# EAGLE design teensy (EAGLE 9.1.1)
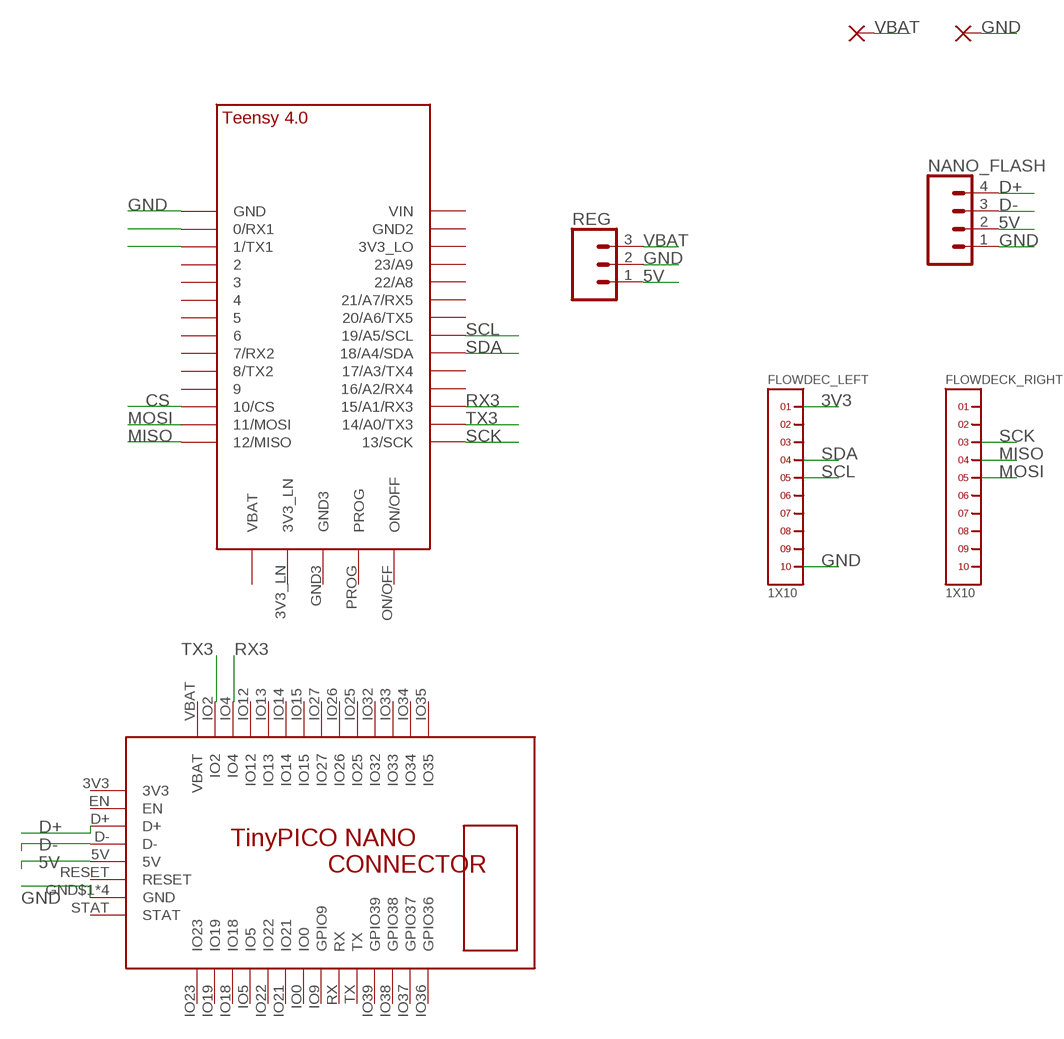
[diagram p0: schematic, sheet 1]

## Parts
FLOWDEC_LEFT  1X10  [1X10]
FLOWDECK_RIGHT  1X10  [1X10]
GND  SMD5  [SMD2,54-5,08]
NANO_FLASH  CONN_041X04_NO_SILK  [1X04_NO_SILK]
REG  CONN_031X03_NO_SILK  [1X03_NO_SILK]
U$1  TEENSY_4.0  [TEENSY_4.0]
U$2  TINYPICO-NANO-CONNECTOR  [TINYPICO-NANO-CONNECTOR]
VBAT  SMD5  [SMD2,54-5,08]

## Nets
3V3: FLOWDEC_LEFT.1
5V: NANO_FLASH.2 REG.1 U$2.5V
CS: U$1.10/CS
D+: NANO_FLASH.4 U$2.D+
D-: NANO_FLASH.3 U$2.D-
GND: FLOWDEC_LEFT.10 GND.1(P) NANO_FLASH.1 REG.2 U$1.GND U$2.GND$1(GND) U$2.GND$2(GND) U$2.GND$3(GND) U$2.GND$4(GND)
MISO: FLOWDECK_RIGHT.4 U$1.12/MISO
MOSI: FLOWDECK_RIGHT.5 U$1.11/MOSI
N$8: U$1.0/RX(0/RX1)
N$9: U$1.1/TX(1/TX1)
RX3: U$1.15/A1(15/A1/RX3) U$2.IO4
SCK: FLOWDECK_RIGHT.3 U$1.13/SCK
SCL: FLOWDEC_LEFT.5 U$1.19/A5/SCL
SDA: FLOWDEC_LEFT.4 U$1.18/A4/SDA
TX3: U$1.14/A0(14/A0/TX3) U$2.IO2
VBAT: REG.3 VBAT.1(P)
Unconnected: FLOWDEC_LEFT.2 FLOWDEC_LEFT.3 FLOWDEC_LEFT.6 FLOWDEC_LEFT.7 FLOWDEC_LEFT.8 FLOWDEC_LEFT.9 FLOWDECK_RIGHT.1 FLOWDECK_RIGHT.2 FLOWDECK_RIGHT.6 FLOWDECK_RIGHT.7 FLOWDECK_RIGHT.8 FLOWDECK_RIGHT.9 FLOWDECK_RIGHT.10 U$1.2 U$1.3/CANTX U$1.3V3_LN U$1.3V3_LO U$1.4/CANRX U$1.5 U$1.6 U$1.7(7/RX2) U$1.8(8/TX2) U$1.9/CS U$1.16/A2(16/A2/RX4) U$1.17/A3(17/A3/TX4) U$1.20/A6(20/A6/TX5) U$1.21/A7(21/A7/RX5) U$1.22/A8 U$1.23/A9 U$1.GND2 U$1.GND3 U$1.ON/OFF U$1.PROG U$1.VBAT\(VBAT) U$1.VIN U$2.EN U$2.IO0 U$2.IO5 U$2.IO9(GPIO9) U$2.IO12 U$2.IO13 U$2.IO14 U$2.IO15 U$2.IO18 U$2.IO19 U$2.IO21 U$2.IO22 U$2.IO23 U$2.IO25 U$2.IO26 U$2.IO27 U$2.IO32 U$2.IO33 U$2.IO34 U$2.IO35 U$2.IO36(GPIO36) U$2.IO37(GPIO37) U$2.IO38(GPIO38) U$2.IO39(GPIO39) U$2.RESET U$2.RX U$2.STAT U$2.TX

## Power pins joined to a net without a drawn wire
3V3: U$2.3V3
VBAT: U$2.VBAT

## Library data of the parts
FLOWDEC_LEFT FLOWDECK_RIGHT = headers(2mm):1X10
GND VBAT = wirepad:SMD5: SMD PAD
NANO_FLASH = SparkFun-Connectors:CONN_04: Multi connection point. Often used as Generic Header-pin footprint for 0.1 inch spaced/style header connections On any of the 0.1 inch spaced packages, you can populate with these: Break Away Headers - Straight <https://www.sparkfun.com/products/116> (PRT-00116) Break Away Male Headers - Right Angle <https://www.sparkfun.com/products/553> (PRT-00553) Female Headers <https://www.sparkfun.com/products/115> (PRT-00115) Break Away Headers - Machine Pin <https://www.sparkfun.com/products/117> (PRT-00117) Break Away Female Headers - Swiss Machine Pin <https://www.sparkfun.com/products/743> (PRT-00743) For SCREWTERMINALS and SPRING TERMINALS visit here: Screw Terimnals on SparkFun.com <https://www.sparkfun.com/search/results?term=Screw+Terminals> (5mm/3.5mm/2.54mm spacing) This device is also useful as a general connection point to wire up your design to another part of your project. Our various solder wires solder well into these plated through hole pads. Hook-Up Wire - Assortment (Stranded, 22 AWG) <https://www.sparkfun.com/products/11375> (PRT-11375) Hook-Up Wire - Assortment (Solid Core, 22 AWG) <https://www.sparkfun.com/products/11367> (PRT-11367) View the entire wire category on our website here <https://www.sparkfun.com/categories/141> Special notes: Molex polarized connector foot print use with SKU : PRT-08231 with associated crimp pins and housings. 1MM SMD Version SKU: PRT-10208; PROD_ID: CONN-09696
REG = SparkFun-Connectors:CONN_03: Multi connection point. Often used as Generic Header-pin footprint for 0.1 inch spaced/style header connections On any of the 0.1 inch spaced packages, you can populate with these: Break Away Headers - Straight <https://www.sparkfun.com/products/116> (PRT-00116) Break Away Male Headers - Right Angle <https://www.sparkfun.com/products/553> (PRT-00553) Female Headers <https://www.sparkfun.com/products/115> (PRT-00115) Break Away Headers - Machine Pin <https://www.sparkfun.com/products/117> (PRT-00117) Break Away Female Headers - Swiss Machine Pin <https://www.sparkfun.com/products/743> (PRT-00743) Stackable Header - 3 Pin (Female, 0.1") <https://www.sparkfun.com/products/13875> (PRT-13875) For SCREWTERMINALS and SPRING TERMINALS visit here: Screw Terimnals on SparkFun.com <https://www.sparkfun.com/search/results?term=Screw+Terminals> (5mm/3.5mm/2.54mm spacing) This device is also useful as a general connection point to wire up your design to another part of your project. Our various solder wires solder well into these plated through hole pads. Hook-Up Wire - Assortment (Stranded, 22 AWG) <https://www.sparkfun.com/products/11375> (PRT-11375) Hook-Up Wire - Assortment (Solid Core, 22 AWG) <https://www.sparkfun.com/products/11367> (PRT-11367) View the entire wire category on our website here <https://www.sparkfun.com/categories/141> Special notes: Molex polarized connector foot print use with SKU : PRT-08232 with associated crimp pins and housings.
U$1 = TEENSY 4.0:TEENSY_4.0
U$2 = TinyPICO_NANO_Eagle:TINYPICO-NANO-CONNECTOR: TinyPICO NANO Footprint https://www.tinypico.com/tinypico-nano

## Board
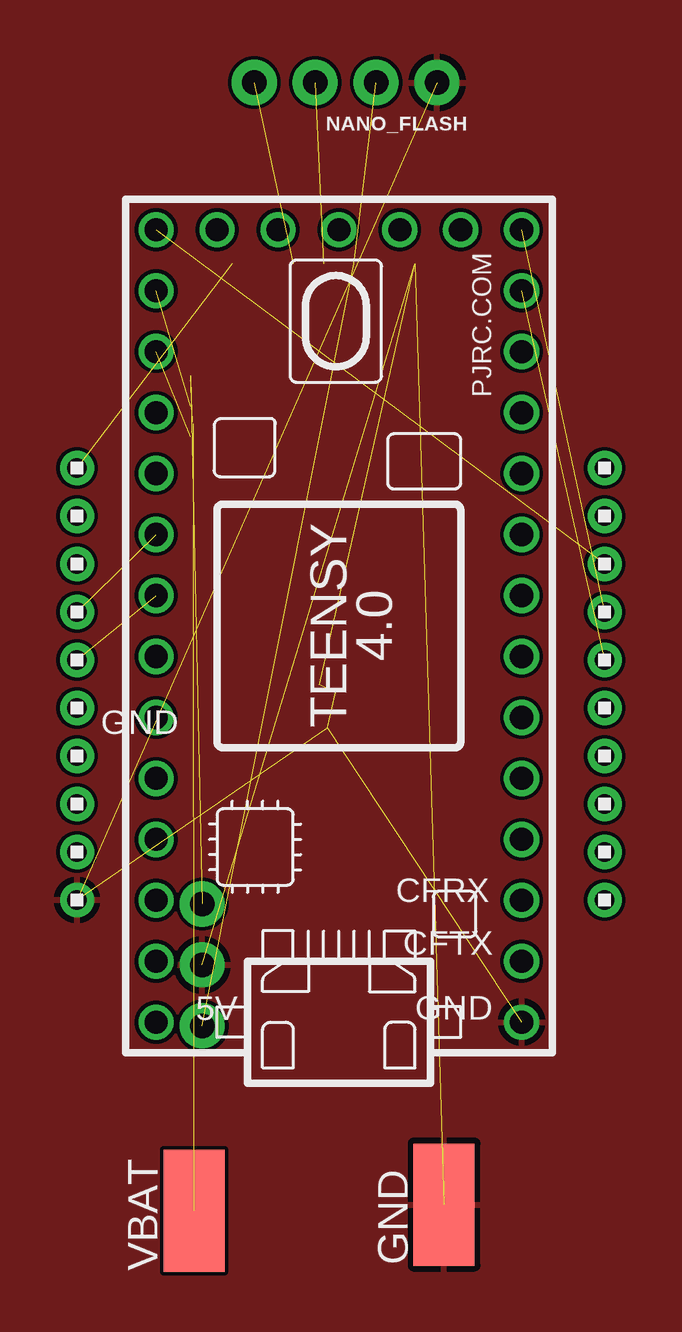
[diagram p1: board, top side]
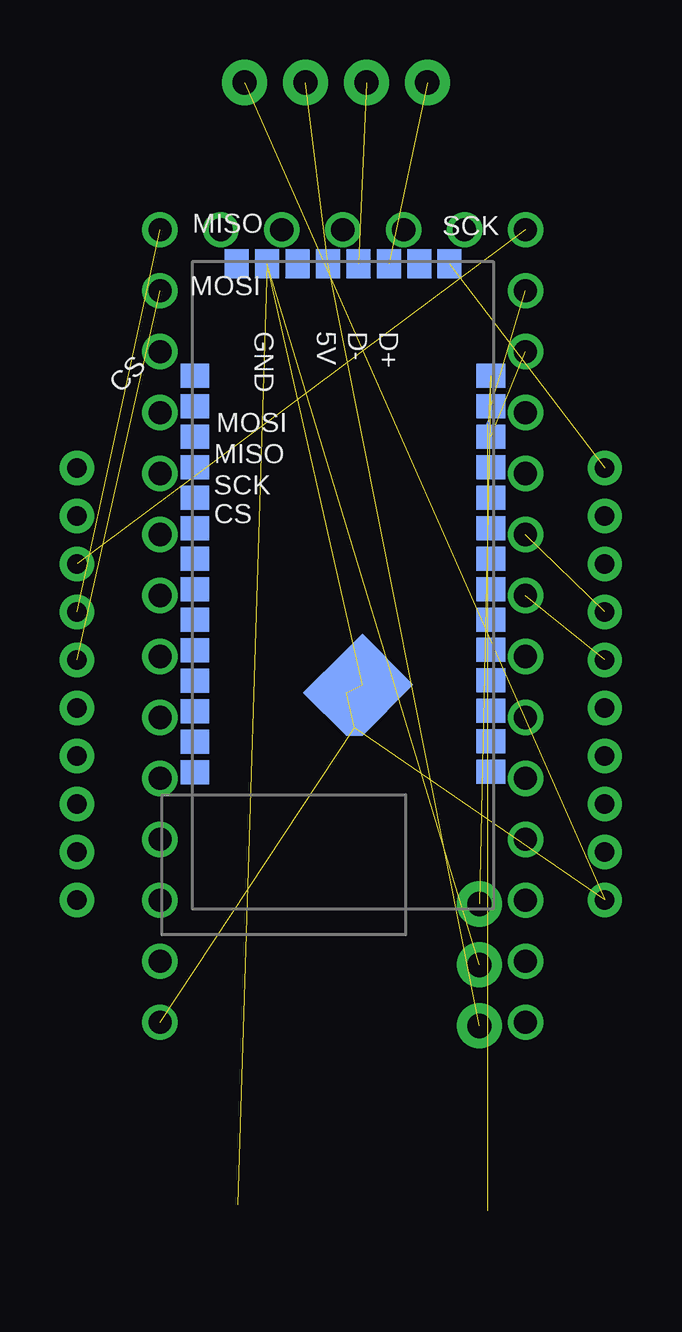
[diagram p2: board, bottom side, seen from below]

No outline drawn. Coordinates in mm, seen from the top.
Copper layers (1*16): Top 0.035mm / dielectric 1.5mm / Bottom 0.035mm
Design rules "default": minimum track width 6mil, minimum drill 0.35mm, track to track 6mil, track to pad 6mil, pad to pad 6mil, via to via 6mil, smd to smd 6mil, copper to edge 40mil, drill to drill 6mil, minimum pad ring 10mil, minimum via ring 8mil, stop-mask expansion 4mil, vias tented up to drill 0mil, thermal gap 10mil
Holes 3.17 mm at 16,46 52,46 52,10 16,10

### Footprints (pad centres in the part's own frame; a part is rotated, then mirrored left to right if it is on the bottom)
1X10 = drill 0.8 pad 1.422: 1 -9,0; 2 -7,0; 3 -5,0; 4 -3,0; 5 -1,0; 6 1,0; 7 3,0; 8 5,0; 9 7,0; 10 9,0
SMD2,54-5,08 = smd 2.54 x 5.08: 1 0,0
1X04_NO_SILK = drill 1.016 pad 1.88: 1 0,0; 2 2.54,0; 3 5.08,0; 4 7.62,0
1X03_NO_SILK = drill 1.016 pad 1.88: 1 0,0; 2 2.54,0; 3 5.08,0
TEENSY_4.0 = drill 0.965: 0/RX -13.97,-7.62; 1/TX -11.43,-7.62; 2 -8.89,-7.62; 3/CANTX -6.35,-7.62; 3V3_LN 16.51,-2.54; 3V3_LO -11.43,7.62; 4/CANRX -3.81,-7.62; 5 -1.27,-7.62; 6 1.27,-7.62; 7 3.81,-7.62; 8 6.35,-7.62; 9/CS 8.89,-7.62; 10/CS 11.43,-7.62; 11/MOSI 13.97,-7.62; 12/MISO 16.51,-7.62; 13/SCK 16.51,7.62; 14/A0 13.97,7.62; 15/A1 11.43,7.62; 16/A2 8.89,7.62; 17/A3 6.35,7.62; 18/A4/SDA 3.81,7.62; 19/A5/SCL 1.27,7.62; 20/A6 -1.27,7.62; 21/A7 -3.81,7.62; 22/A8 -6.35,7.62; 23/A9 -8.89,7.62; GND -16.51,-7.62; GND2 -13.97,7.62; GND3 16.51,0; ON/OFF 16.51,5.08; PROG 16.51,2.54; VBAT\ 16.51,-5.08; VIN -16.51,7.62
TINYPICO-NANO-CONNECTOR = smd 1.2 x 1: 3V3 0.1,10.725; 5V 0.1,5.645; D+ 0.1,8.185; D- 0.1,6.915; EN 0.1,9.455; GND$1 0.1,3.105; RESET 0.1,4.375; STAT 0.1,1.835 | smd 3 x 3 rotated 45: GND$2 17.643,7.082 | smd 0.66 x 0.671: GND$3 19.436,6.746 | smd 2.54 x 2.54 rotated 45: GND$4 17.971,6.413 | smd 1 x 1.2: IO0 12.395,0.1; IO2 6.034,12.44; IO4 7.304,12.44; IO5 8.585,0.1; IO9 13.665,0.1; IO12 8.574,12.44; IO13 9.844,12.44; IO14 11.114,12.44; IO15 12.384,12.44; IO18 7.315,0.1; IO19 6.045,0.1; IO21 11.125,0.1; IO22 9.855,0.1; IO23 4.775,0.1; IO25 16.194,12.44; IO26 14.924,12.44; IO27 13.654,12.44; IO32 17.464,12.44; IO33 18.734,12.44; IO34 20.004,12.44; IO35 21.274,12.44; IO36 21.285,0.1; IO37 20.015,0.1; IO38 18.745,0.1; IO39 17.475,0.1; RX 14.935,0.1; TX 16.205,0.1; VBAT 4.764,12.44

### Placement (x,y rotation side)
FLOWDEC_LEFT  23,27 270 top
FLOWDECK_RIGHT  45,27 270 top
GND  38.31,5.31 0 top
NANO_FLASH  38.01,52.06 180 top
REG  28.22,12.75 90 top
U$1  33.92,29.42 90 top
U$2  40.19,44.61 270 bottom
VBAT  27.88,5.06 0 top

### Tracks (layer width: path | path; a pad name or v marks a point on that pad's centre or on a via)
3V3  (1 unrouted)
5V  (2 unrouted)
D+  (1 unrouted)
D-  (1 unrouted)
GND  (8 unrouted)
  pour Top: 6.1,63.9 68.5,63.9 68.5,-0.7 6.1,-0.7
MISO  (1 unrouted)
MOSI  (1 unrouted)
RX3  (1 unrouted)
SCK  (1 unrouted)
SCL  (1 unrouted)
SDA  (1 unrouted)
TX3  (1 unrouted)
VBAT  (3 unrouted)
  Bottom 0.152: 27.82,37.93 27.87,37.84

### Text on the board
tNames: VBAT | GND | 5V | GND | CFRX | CFTX | 5V | GND
bNames: VBAT | GND | 5V | SCK | MISO | MOSI | D+ | D- | 5V | GND | CS | MOSI | MISO | SCK | CS